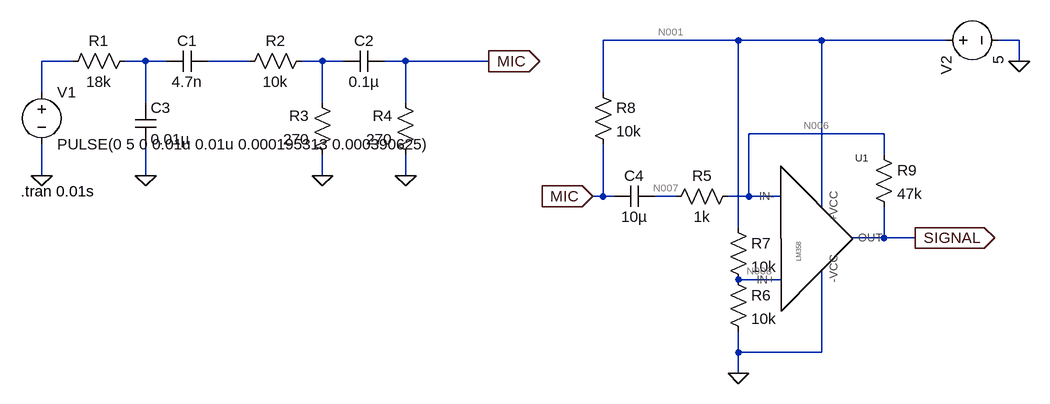
[diagram p0: schematic cmt-out-4.asc]
cmt-out-4.asc, the LTspice schematic file:
Version 4
SHEET 1 1840 680
WIRE 1072 -144 864 -144
WIRE 1200 -144 1072 -144
WIRE 1392 -144 1200 -144
WIRE 1504 -144 1472 -144
WIRE 48 -112 0 -112
WIRE 160 -112 128 -112
WIRE 192 -112 160 -112
WIRE 320 -112 256 -112
WIRE 432 -112 400 -112
WIRE 464 -112 432 -112
WIRE 560 -112 528 -112
WIRE 688 -112 560 -112
WIRE 1504 -112 1504 -144
WIRE 0 -64 0 -112
WIRE 864 -64 864 -144
WIRE 160 -48 160 -112
WIRE 432 -48 432 -112
WIRE 560 -48 560 -112
WIRE 1296 0 1088 0
WIRE 1296 32 1296 0
WIRE 0 64 0 16
WIRE 160 64 160 16
WIRE 432 64 432 32
WIRE 560 64 560 32
WIRE 864 96 864 16
WIRE 864 96 848 96
WIRE 880 96 864 96
WIRE 976 96 944 96
WIRE 1088 96 1088 0
WIRE 1088 96 1056 96
WIRE 1136 96 1088 96
WIRE 1200 112 1200 -144
WIRE 1072 144 1072 -144
WIRE 1296 160 1296 112
WIRE 1296 160 1248 160
WIRE 1344 160 1296 160
WIRE 1136 224 1072 224
WIRE 1072 336 1072 304
WIRE 1200 336 1200 208
WIRE 1200 336 1072 336
WIRE 1072 368 1072 336
FLAG 0 64 0
FLAG 432 64 0
FLAG 560 64 0
FLAG 160 64 0
FLAG 688 -112 MIC
IOPIN 688 -112 Out
FLAG 848 96 MIC
IOPIN 848 96 In
FLAG 1504 -112 0
FLAG 1344 160 SIGNAL
IOPIN 1344 160 Out
FLAG 1072 368 0
SYMBOL voltage 0 -80 R0
WINDOW 123 0 0 Left 2
WINDOW 39 0 0 Left 2
SYMATTR InstName V1
SYMATTR Value PULSE(0 5 0 0.01u 0.01u 0.000195313 0.000390625)
SYMBOL res 144 -128 R90
WINDOW 0 0 56 VBottom 2
WINDOW 3 32 56 VTop 2
SYMATTR InstName R1
SYMATTR Value 18k
SYMBOL res 416 -128 R90
WINDOW 0 0 56 VBottom 2
WINDOW 3 32 56 VTop 2
SYMATTR InstName R2
SYMATTR Value 10k
SYMBOL res 448 48 R180
WINDOW 0 36 76 Left 2
WINDOW 3 36 40 Left 2
SYMATTR InstName R3
SYMATTR Value 270
SYMBOL res 576 48 R180
WINDOW 0 36 76 Left 2
WINDOW 3 36 40 Left 2
SYMATTR InstName R4
SYMATTR Value 270
SYMBOL cap 256 -128 R90
WINDOW 0 0 32 VBottom 2
WINDOW 3 32 32 VTop 2
SYMATTR InstName C1
SYMATTR Value 4.7n
SYMBOL cap 528 -128 R90
WINDOW 0 0 32 VBottom 2
WINDOW 3 32 32 VTop 2
SYMATTR InstName C2
SYMATTR Value 0.1µ
SYMBOL cap 144 -48 R0
SYMATTR InstName C3
SYMATTR Value 0.01µ
SYMBOL cap 944 80 R90
WINDOW 0 0 32 VBottom 2
WINDOW 3 32 32 VTop 2
SYMATTR InstName C4
SYMATTR Value 10µ
SYMBOL voltage 1376 -144 M90
WINDOW 123 0 0 Left 2
WINDOW 39 0 0 Left 2
SYMATTR InstName V2
SYMATTR Value 5
SYMBOL res 848 -80 R0
SYMATTR InstName R8
SYMATTR Value 10k
SYMBOL res 1072 80 R90
WINDOW 0 0 56 VBottom 2
WINDOW 3 32 56 VTop 2
SYMATTR InstName R5
SYMATTR Value 1k
SYMBOL lm358 1184 160 R0
SYMATTR InstName U1
SYMBOL res 1056 208 R0
SYMATTR InstName R6
SYMATTR Value 10k
SYMBOL res 1056 128 R0
SYMATTR InstName R7
SYMATTR Value 10k
SYMBOL res 1280 16 R0
SYMATTR InstName R9
SYMATTR Value 47k
TEXT -32 88 Left 2 !.tran 0.01s

The netlist it stands for:
* cmt-out-4.asc
V1 N002 0 PULSE(0 5 0 0.01u 0.01u 0.000195313 0.000390625)
R1 N003 N002 18k
R2 N005 N004 10k
R3 0 N005 270
R4 0 MIC 270
C1 N004 N003 4.7n
C2 MIC N005 0.1µ
C3 N003 0 0.01µ
C4 N007 MIC 10µ
V2 N001 0 5
R8 N001 MIC 10k
R5 N006 N007 1k
XU1 N008 N006 N001 0 SIGNAL LM358/NS LM358/NS LM358/NS  ; pins IN+ IN- +VCC -VCC OUT
R6 N008 0 10k
R7 N001 N008 10k
R9 N006 SIGNAL 47k
.tran 0.01s
.lib LM358.MOD
.backanno
.end

* Results of the author's LTspice run, read from the files saved beside the schematic
* Operating Point, zero values left out:
*   V(mic) = 131.5 mV
*   V(n007) = 2.502 V
*   V(n001) = 5 V
*   V(n006) = 2.502 V
*   V(n008) = 2.5 V
*   V(signal) = 2.5 V
*   I(R9) = 37.96 nA
*   I(R7) = 250 µA
*   I(R6) = 250 µA
*   I(R8) = 486.9 µA
*   I(R4) = -486.9 µA
*   I(V2) = -690.4 µA
*   Ix(u1:1) = -51.96 nA
*   Ix(u1:2) = -37.96 nA
*   Ix(u1:99) = -46.42 µA
*   Ix(u1:50) = 46.47 µA
*   Ix(u1:28) = 37.96 nA
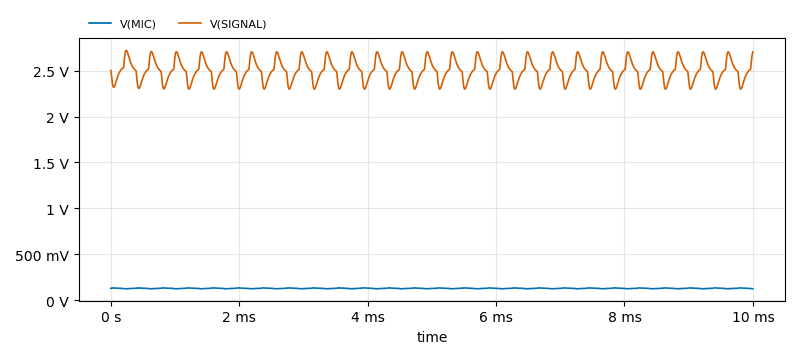
[diagram p1: Transient Analysis of cmt-out-4.asc, plotted from the saved traces]
* Transient Analysis, 1 run:
*   V(MIC): min 126.6 mV, max 136 mV, average 131.5 mV, rms 131.5 mV, last 126.9 mV
*   V(SIGNAL): min 2.297 V, max 2.719 V, average 2.5 V, rms 2.503 V, last 2.703 V